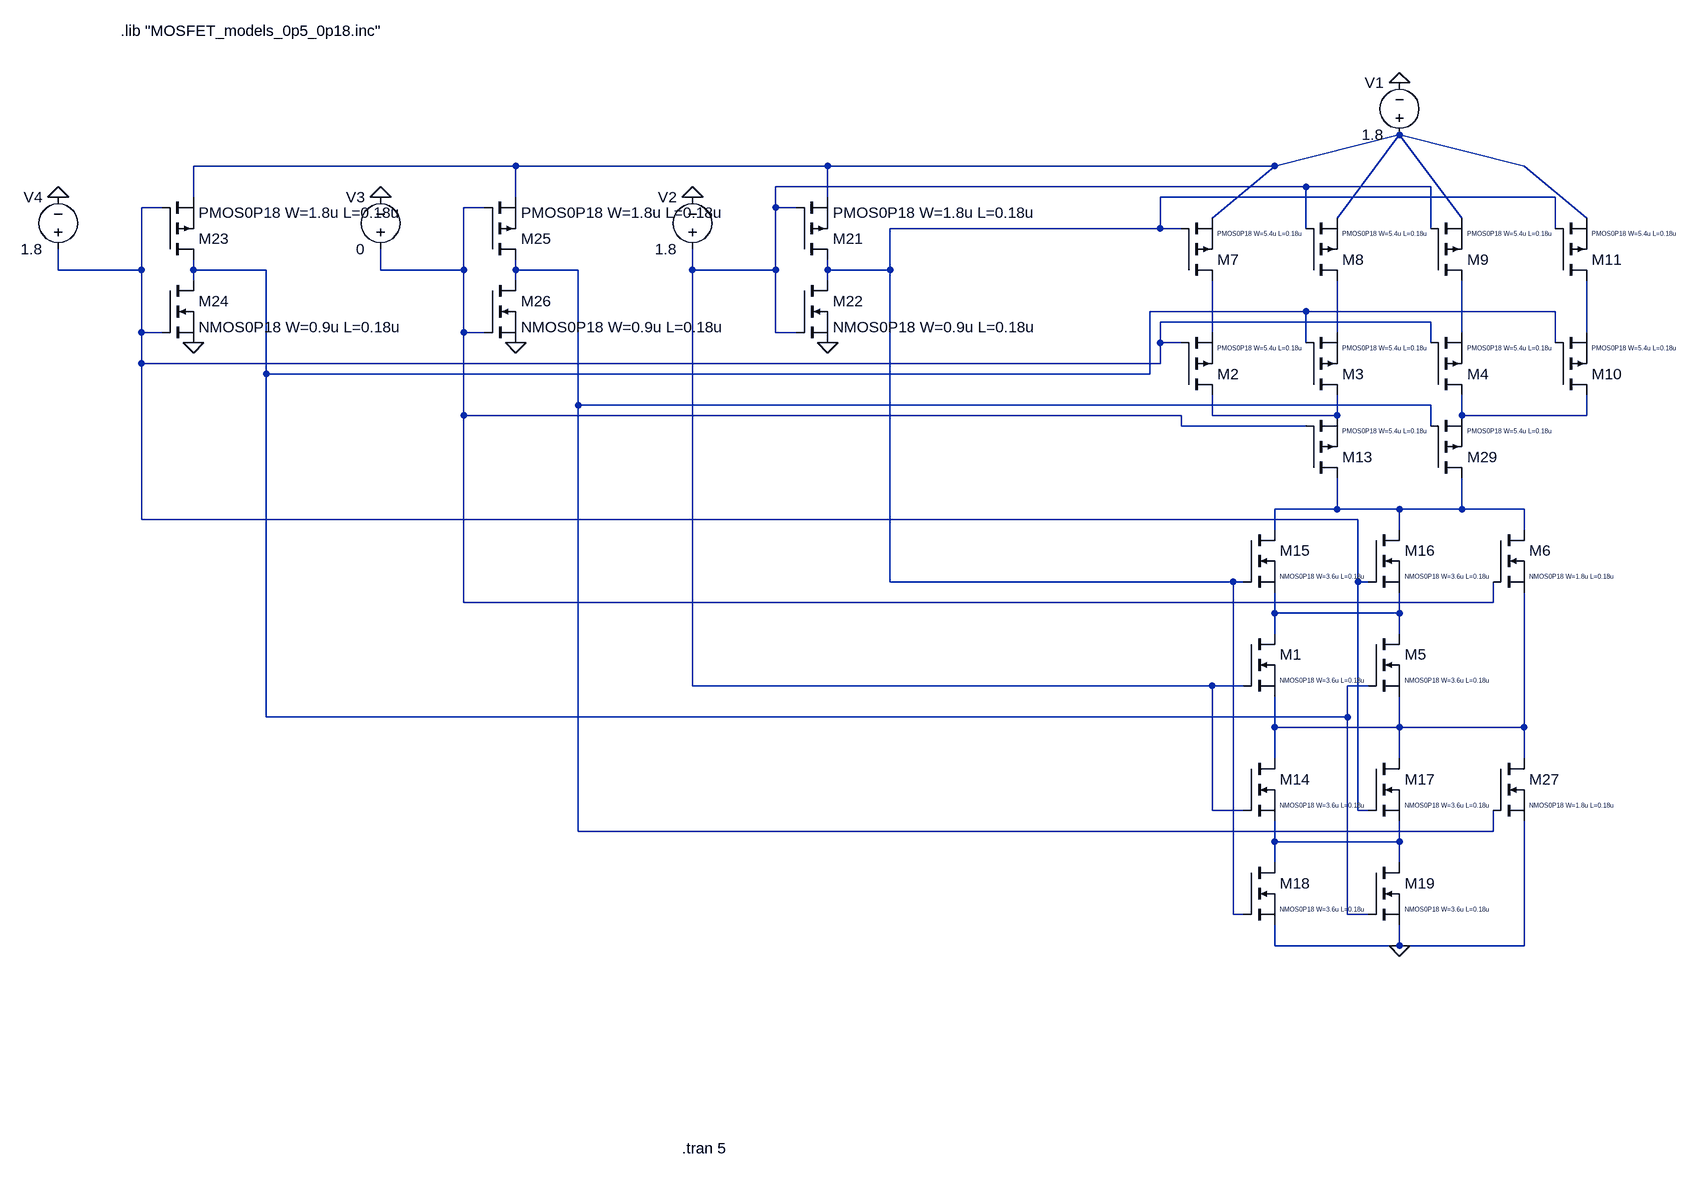
[diagram p0: schematic 3_INPUT_ODD_PARITY.asc]
3_INPUT_ODD_PARITY.asc, the LTspice schematic file:
Version 4
SHEET 1 1664 1360
WIRE -880 -384 -1376 -384
WIRE -400 -384 -880 -384
WIRE 288 -384 480 -432
WIRE 288 -384 -400 -384
WIRE 672 -384 480 -432
WIRE 336 -352 -480 -352
WIRE 528 -352 336 -352
WIRE -1376 -336 -1376 -384
WIRE -880 -336 -880 -384
WIRE -400 -336 -400 -384
WIRE 720 -336 112 -336
WIRE -1424 -320 -1456 -320
WIRE -928 -320 -960 -320
WIRE -480 -320 -480 -352
WIRE -448 -320 -480 -320
WIRE 192 -304 288 -384
WIRE 384 -304 480 -432
WIRE 576 -304 480 -432
WIRE 768 -304 672 -384
WIRE 112 -288 112 -336
WIRE 112 -288 -304 -288
WIRE 144 -288 112 -288
WIRE 336 -288 336 -352
WIRE 528 -288 528 -352
WIRE 720 -288 720 -336
WIRE -1584 -224 -1584 -256
WIRE -1456 -224 -1456 -320
WIRE -1456 -224 -1584 -224
WIRE -1376 -224 -1376 -240
WIRE -1264 -224 -1376 -224
WIRE -1088 -224 -1088 -256
WIRE -960 -224 -960 -320
WIRE -960 -224 -1088 -224
WIRE -880 -224 -880 -240
WIRE -784 -224 -880 -224
WIRE -608 -224 -608 -256
WIRE -480 -224 -480 -320
WIRE -480 -224 -608 -224
WIRE -400 -224 -400 -240
WIRE -304 -224 -304 -288
WIRE -304 -224 -400 -224
WIRE -1376 -208 -1376 -224
WIRE -880 -208 -880 -224
WIRE -400 -208 -400 -224
WIRE 336 -160 96 -160
WIRE 720 -160 336 -160
WIRE 528 -144 112 -144
WIRE -1456 -128 -1456 -224
WIRE -1424 -128 -1456 -128
WIRE -960 -128 -960 -224
WIRE -928 -128 -960 -128
WIRE -480 -128 -480 -224
WIRE -448 -128 -480 -128
WIRE 192 -128 192 -208
WIRE 384 -128 384 -208
WIRE 576 -128 576 -208
WIRE 768 -128 768 -208
WIRE 112 -112 112 -144
WIRE 144 -112 112 -112
WIRE 336 -112 336 -160
WIRE 528 -112 528 -144
WIRE 720 -112 720 -160
WIRE -1456 -80 -1456 -128
WIRE 112 -80 112 -112
WIRE 112 -80 -1456 -80
WIRE -1264 -64 -1264 -224
WIRE 96 -64 96 -160
WIRE 96 -64 -1264 -64
WIRE -784 -16 -784 -224
WIRE 528 -16 -784 -16
WIRE -960 0 -960 -128
WIRE 144 0 -960 0
WIRE 192 0 192 -32
WIRE 384 0 384 -32
WIRE 384 0 192 0
WIRE 576 0 576 -32
WIRE 768 0 768 -32
WIRE 768 0 576 0
WIRE 144 16 144 0
WIRE 336 16 144 16
WIRE 528 16 528 -16
WIRE 384 144 384 96
WIRE 384 144 288 144
WIRE 480 144 384 144
WIRE 576 144 576 96
WIRE 576 144 480 144
WIRE 672 144 576 144
WIRE -1456 160 -1456 -80
WIRE 416 160 -1456 160
WIRE 288 176 288 144
WIRE 480 176 480 144
WIRE 672 176 672 144
WIRE -304 256 -304 -224
WIRE 224 256 -304 256
WIRE 240 256 224 256
WIRE 416 256 416 160
WIRE 432 256 416 256
WIRE -960 288 -960 0
WIRE 624 288 624 256
WIRE 624 288 -960 288
WIRE 288 304 288 272
WIRE 480 304 480 272
WIRE 480 304 288 304
WIRE 288 336 288 304
WIRE 480 336 480 304
WIRE -608 416 -608 -224
WIRE 192 416 -608 416
WIRE 240 416 192 416
WIRE 432 416 400 416
WIRE -1264 464 -1264 -64
WIRE 400 464 400 416
WIRE 400 464 -1264 464
WIRE 288 480 288 432
WIRE 480 480 480 432
WIRE 480 480 288 480
WIRE 672 480 672 272
WIRE 672 480 480 480
WIRE 288 528 288 480
WIRE 480 528 480 480
WIRE 672 528 672 480
WIRE 192 608 192 416
WIRE 240 608 192 608
WIRE 416 608 416 256
WIRE 432 608 416 608
WIRE -784 640 -784 -16
WIRE 624 640 624 608
WIRE 624 640 -784 640
WIRE 288 656 288 624
WIRE 480 656 480 624
WIRE 480 656 288 656
WIRE 288 688 288 656
WIRE 480 688 480 656
WIRE 224 768 224 256
WIRE 240 768 224 768
WIRE 400 768 400 464
WIRE 432 768 400 768
WIRE 288 816 288 784
WIRE 480 816 480 784
WIRE 480 816 288 816
WIRE 672 816 672 624
WIRE 672 816 480 816
FLAG 480 -512 0
FLAG -608 -336 0
FLAG -400 -112 0
FLAG -1584 -336 0
FLAG -1376 -112 0
FLAG -1088 -336 0
FLAG -880 -112 0
FLAG 480 816 0
SYMBOL pmos 144 -32 M180
WINDOW 3 56 72 Left 0
SYMATTR InstName M2
SYMATTR Value PMOS0P18 W=5.4u L=0.18u
SYMBOL pmos 336 -32 M180
WINDOW 3 56 72 Left 0
SYMATTR InstName M3
SYMATTR Value PMOS0P18 W=5.4u L=0.18u
SYMBOL pmos 528 -32 M180
WINDOW 3 56 72 Left 0
SYMATTR InstName M4
SYMATTR Value PMOS0P18 W=5.4u L=0.18u
SYMBOL pmos 144 -208 M180
WINDOW 3 56 72 Left 0
SYMATTR InstName M7
SYMATTR Value PMOS0P18 W=5.4u L=0.18u
SYMBOL pmos 336 -208 M180
WINDOW 3 56 72 Left 0
SYMATTR InstName M8
SYMATTR Value PMOS0P18 W=5.4u L=0.18u
SYMBOL pmos 528 -208 M180
WINDOW 3 56 72 Left 0
SYMATTR InstName M9
SYMATTR Value PMOS0P18 W=5.4u L=0.18u
SYMBOL pmos 720 -32 M180
WINDOW 3 56 72 Left 0
SYMATTR InstName M10
SYMATTR Value PMOS0P18 W=5.4u L=0.18u
SYMBOL pmos 720 -208 M180
WINDOW 3 56 72 Left 0
SYMATTR InstName M11
SYMATTR Value PMOS0P18 W=5.4u L=0.18u
SYMBOL nmos 240 176 R0
WINDOW 3 56 72 Left 0
SYMATTR InstName M15
SYMATTR Value NMOS0P18 W=3.6u L=0.18u
SYMBOL nmos 432 176 R0
WINDOW 3 56 72 Left 0
SYMATTR InstName M16
SYMATTR Value NMOS0P18 W=3.6u L=0.18u
SYMBOL voltage 480 -416 R180
WINDOW 0 24 96 Left 2
WINDOW 3 24 16 Left 2
WINDOW 123 0 0 Left 0
WINDOW 39 0 0 Left 0
SYMATTR InstName V1
SYMATTR Value 1.8
SYMBOL pmos -448 -240 M180
SYMATTR InstName M21
SYMATTR Value PMOS0P18 W=1.8u L=0.18u
SYMBOL nmos -448 -208 R0
SYMATTR InstName M22
SYMATTR Value NMOS0P18 W=0.9u L=0.18u
SYMBOL pmos -1424 -240 M180
SYMATTR InstName M23
SYMATTR Value PMOS0P18 W=1.8u L=0.18u
SYMBOL nmos -1424 -208 R0
SYMATTR InstName M24
SYMATTR Value NMOS0P18 W=0.9u L=0.18u
SYMBOL pmos -928 -240 M180
SYMATTR InstName M25
SYMATTR Value PMOS0P18 W=1.8u L=0.18u
SYMBOL nmos -928 -208 R0
SYMATTR InstName M26
SYMATTR Value NMOS0P18 W=0.9u L=0.18u
SYMBOL nmos 240 336 R0
WINDOW 3 56 72 Left 0
SYMATTR InstName M1
SYMATTR Value NMOS0P18 W=3.6u L=0.18u
SYMBOL nmos 432 336 R0
WINDOW 3 56 72 Left 0
SYMATTR InstName M5
SYMATTR Value NMOS0P18 W=3.6u L=0.18u
SYMBOL nmos 624 176 R0
WINDOW 3 56 72 Left 0
SYMATTR InstName M6
SYMATTR Value NMOS0P18 W=1.8u L=0.18u
SYMBOL nmos 432 528 R0
WINDOW 3 56 72 Left 0
SYMATTR InstName M17
SYMATTR Value NMOS0P18 W=3.6u L=0.18u
SYMBOL nmos 240 688 R0
WINDOW 3 56 72 Left 0
SYMATTR InstName M18
SYMATTR Value NMOS0P18 W=3.6u L=0.18u
SYMBOL nmos 432 688 R0
WINDOW 3 56 72 Left 0
SYMATTR InstName M19
SYMATTR Value NMOS0P18 W=3.6u L=0.18u
SYMBOL nmos 240 528 R0
WINDOW 3 56 72 Left 0
SYMATTR InstName M14
SYMATTR Value NMOS0P18 W=3.6u L=0.18u
SYMBOL nmos 624 528 R0
WINDOW 3 56 72 Left 0
SYMATTR InstName M27
SYMATTR Value NMOS0P18 W=1.8u L=0.18u
SYMBOL voltage -608 -240 R180
WINDOW 0 24 96 Left 2
WINDOW 3 24 16 Left 2
WINDOW 123 0 0 Left 0
WINDOW 39 0 0 Left 0
SYMATTR InstName V2
SYMATTR Value 1.8
SYMBOL voltage -1088 -240 R180
WINDOW 0 24 96 Left 2
WINDOW 3 24 16 Left 2
WINDOW 123 0 0 Left 0
WINDOW 39 0 0 Left 0
SYMATTR InstName V3
SYMATTR Value 0
SYMBOL voltage -1584 -240 R180
WINDOW 0 24 96 Left 2
WINDOW 3 24 16 Left 2
WINDOW 123 0 0 Left 0
WINDOW 39 0 0 Left 0
SYMATTR InstName V4
SYMATTR Value 1.8
SYMBOL pmos 336 96 M180
WINDOW 3 56 72 Left 0
SYMATTR InstName M13
SYMATTR Value PMOS0P18 W=5.4u L=0.18u
SYMBOL pmos 528 96 M180
WINDOW 3 56 72 Left 0
SYMATTR InstName M29
SYMATTR Value PMOS0P18 W=5.4u L=0.18u
TEXT -624 1128 Left 2 !.tran 5
TEXT -1488 -592 Left 2 !.lib "MOSFET_models_0p5_0p18.inc"

The netlist it stands for:
* 3_INPUT_ODD_PARITY.asc
M2 N012 N004 N008 N008 PMOS0P18 W=5.4u L=0.18u
M3 N012 N006 N009 N009 PMOS0P18 W=5.4u L=0.18u
M4 N013 N004 N010 N010 PMOS0P18 W=5.4u L=0.18u
M7 N008 N003 N001 N001 PMOS0P18 W=5.4u L=0.18u
M8 N009 N002 N001 N001 PMOS0P18 W=5.4u L=0.18u
M9 N010 N002 N001 N001 PMOS0P18 W=5.4u L=0.18u
M10 N013 N006 N011 N011 PMOS0P18 W=5.4u L=0.18u
M11 N011 N003 N001 N001 PMOS0P18 W=5.4u L=0.18u
M15 N014 N003 N015 N015 NMOS0P18 W=3.6u L=0.18u
M16 N014 N004 N015 N015 NMOS0P18 W=3.6u L=0.18u
V1 N001 0 1.8
M21 N003 N002 N001 N001 PMOS0P18 W=1.8u L=0.18u
M22 N003 N002 0 0 NMOS0P18 W=0.9u L=0.18u
M23 N006 N004 N001 N001 PMOS0P18 W=1.8u L=0.18u
M24 N006 N004 0 0 NMOS0P18 W=0.9u L=0.18u
M25 N007 N005 N001 N001 PMOS0P18 W=1.8u L=0.18u
M26 N007 N005 0 0 NMOS0P18 W=0.9u L=0.18u
M1 N015 N002 N016 N016 NMOS0P18 W=3.6u L=0.18u
M5 N015 N006 N016 N016 NMOS0P18 W=3.6u L=0.18u
M6 N014 N005 N016 N016 NMOS0P18 W=1.8u L=0.18u
M17 N016 N004 N017 N017 NMOS0P18 W=3.6u L=0.18u
M18 N017 N003 0 0 NMOS0P18 W=3.6u L=0.18u
M19 N017 N006 0 0 NMOS0P18 W=3.6u L=0.18u
M14 N016 N002 N017 N017 NMOS0P18 W=3.6u L=0.18u
M27 N016 N007 0 0 NMOS0P18 W=1.8u L=0.18u
V2 N002 0 1.8
V3 N005 0 0
V4 N004 0 1.8
M13 N014 N005 N012 N012 PMOS0P18 W=5.4u L=0.18u
M29 N014 N007 N013 N013 PMOS0P18 W=5.4u L=0.18u
.model NMOS NMOS
.model PMOS PMOS
.lib standard.mos
.tran 5
.lib "MOSFET_models_0p5_0p18.inc"
.backanno
.end